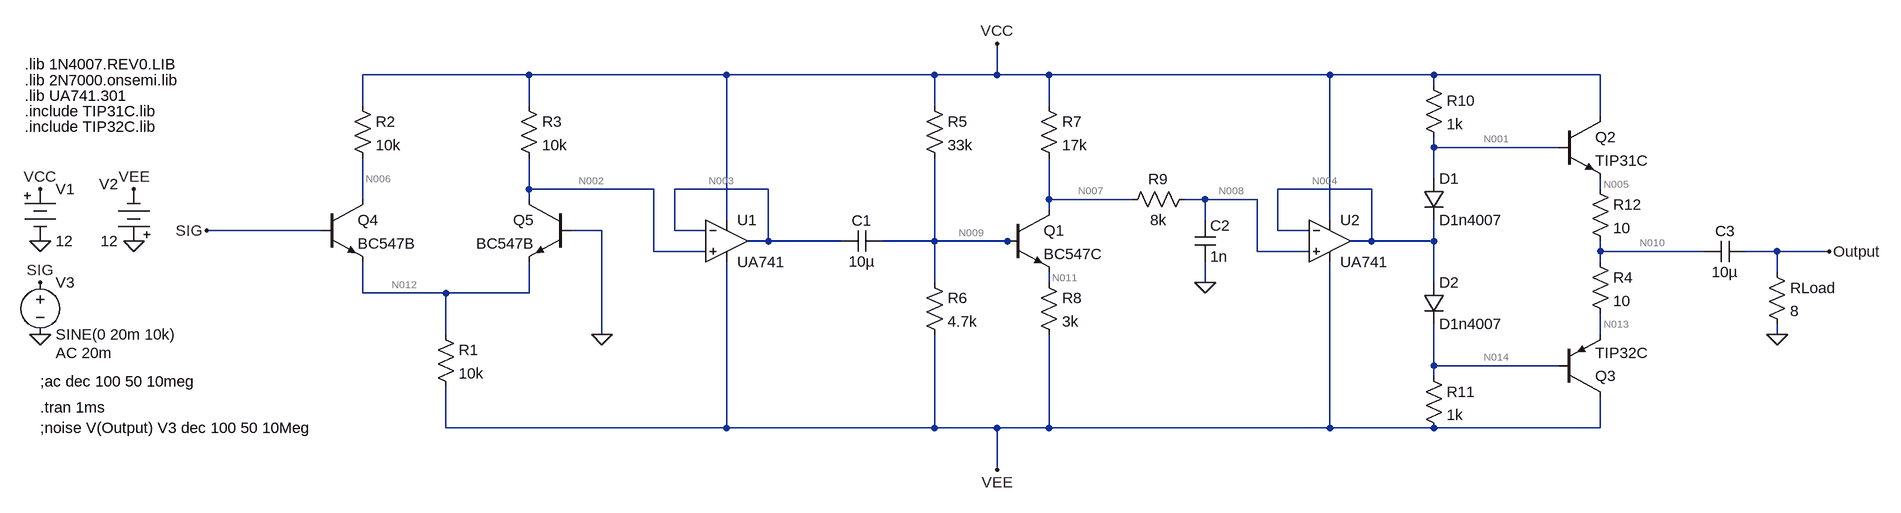
[diagram p0: schematic Final_Schematic.asc]
Final_Schematic.asc, the LTspice schematic file:
Version 4
SHEET 1 3124 736
WIRE 832 32 576 32
WIRE 1136 32 832 32
WIRE 1456 32 1136 32
WIRE 1552 32 1552 -16
WIRE 1552 32 1456 32
WIRE 1632 32 1552 32
WIRE 2064 32 1632 32
WIRE 2224 32 2064 32
WIRE 2480 32 2224 32
WIRE 2224 48 2224 32
WIRE 576 80 576 32
WIRE 832 80 832 32
WIRE 1456 80 1456 32
WIRE 1632 80 1632 32
WIRE 2480 96 2480 32
WIRE 2224 144 2224 128
WIRE 2416 144 2224 144
WIRE 2224 192 2224 144
WIRE 832 208 832 160
WIRE 1024 208 832 208
WIRE 1200 208 1056 208
WIRE 2128 208 1984 208
WIRE 2480 208 2480 192
WIRE 576 224 576 160
WIRE 832 224 832 208
WIRE 1632 224 1632 160
WIRE 1760 224 1632 224
WIRE 1872 224 1840 224
WIRE 1952 224 1872 224
WIRE 1632 240 1632 224
WIRE 1136 256 1136 32
WIRE 1872 256 1872 224
WIRE 2064 256 2064 32
WIRE 512 272 336 272
WIRE 944 272 896 272
WIRE 1056 272 1056 208
WIRE 1104 272 1056 272
WIRE 1984 272 1984 208
WIRE 2032 272 1984 272
WIRE 1200 288 1200 208
WIRE 1200 288 1168 288
WIRE 1312 288 1200 288
WIRE 1456 288 1456 160
WIRE 1456 288 1376 288
WIRE 1568 288 1456 288
WIRE 1584 288 1568 288
WIRE 2128 288 2128 208
WIRE 2128 288 2096 288
WIRE 2224 288 2224 256
WIRE 2224 288 2128 288
WIRE 1024 304 1024 208
WIRE 1104 304 1024 304
WIRE 1952 304 1952 224
WIRE 2032 304 1952 304
WIRE 2480 304 2480 288
WIRE 2640 304 2480 304
WIRE 2752 304 2704 304
WIRE 2832 304 2752 304
WIRE 2480 320 2480 304
WIRE 2752 336 2752 304
WIRE 1456 352 1456 288
WIRE 1632 352 1632 336
WIRE 1872 352 1872 320
WIRE 2224 352 2224 288
WIRE 576 368 576 320
WIRE 704 368 576 368
WIRE 832 368 832 320
WIRE 832 368 704 368
WIRE 704 432 704 368
WIRE 944 432 944 272
WIRE 2480 432 2480 400
WIRE 2752 432 2752 416
WIRE 2224 480 2224 416
WIRE 2416 480 2224 480
WIRE 2224 496 2224 480
WIRE 704 576 704 512
WIRE 1136 576 1136 320
WIRE 1136 576 704 576
WIRE 1456 576 1456 432
WIRE 1456 576 1136 576
WIRE 1552 576 1456 576
WIRE 1632 576 1632 432
WIRE 1632 576 1552 576
WIRE 2064 576 2064 320
WIRE 2064 576 1632 576
WIRE 2224 576 2064 576
WIRE 2480 576 2480 528
WIRE 2480 576 2224 576
WIRE 1552 640 1552 576
FLAG 80 288 0
FLAG 224 288 0
FLAG 80 208 VCC
FLAG 224 208 VEE
FLAG 80 432 0
FLAG 80 352 SIG
FLAG 944 432 0
FLAG 1872 352 0
FLAG 1552 640 VEE
FLAG 1552 -16 VCC
FLAG 2752 432 0
FLAG 336 272 SIG
FLAG 2832 304 Output
SYMBOL Misc\\battery 80 192 R0
WINDOW 123 0 0 Left 0
WINDOW 39 0 0 Left 0
SYMATTR InstName V1
SYMATTR Value 12
SYMBOL Misc\\battery 224 304 R180
WINDOW 0 24 104 Left 2
WINDOW 3 24 16 Left 2
WINDOW 123 0 0 Left 0
WINDOW 39 0 0 Left 0
SYMATTR InstName V2
SYMATTR Value 12
SYMBOL voltage 80 336 R0
WINDOW 123 24 124 Left 2
WINDOW 39 0 0 Left 0
SYMATTR Value2 AC 20m
SYMATTR InstName V3
SYMATTR Value SINE(0 20m 10k)
SYMBOL res 688 416 R0
SYMATTR InstName R1
SYMATTR Value 10k
SYMBOL res 560 64 R0
SYMATTR InstName R2
SYMATTR Value 10k
SYMBOL res 816 64 R0
SYMATTR InstName R3
SYMATTR Value 10k
SYMBOL OpAmps\\opamp2 1136 224 R0
SYMATTR InstName U1
SYMATTR Value UA741
SYMBOL cap 1376 272 R90
WINDOW 0 0 32 VBottom 2
WINDOW 3 32 32 VTop 2
SYMATTR InstName C1
SYMATTR Value 10µ
SYMBOL res 1440 64 R0
SYMATTR InstName R5
SYMATTR Value 33k
SYMBOL res 1440 336 R0
SYMATTR InstName R6
SYMATTR Value 4.7k
SYMBOL npn 1568 240 R0
SYMATTR InstName Q1
SYMATTR Value BC547C
SYMBOL res 1616 64 R0
SYMATTR InstName R7
SYMATTR Value 17k
SYMBOL res 1616 336 R0
SYMATTR InstName R8
SYMATTR Value 3k
SYMBOL res 1856 208 R90
WINDOW 0 0 56 VBottom 2
WINDOW 3 32 56 VTop 2
SYMATTR InstName R9
SYMATTR Value 8k
SYMBOL cap 1856 256 R0
SYMATTR InstName C2
SYMATTR Value 1n
SYMBOL OpAmps\\opamp2 2064 224 R0
SYMATTR InstName U2
SYMATTR Value UA741
SYMBOL res 2208 32 R0
SYMATTR InstName R10
SYMATTR Value 1k
SYMBOL diode 2208 192 R0
SYMATTR InstName D1
SYMATTR Value D1n4007
SYMBOL res 2208 480 R0
SYMATTR InstName R11
SYMATTR Value 1k
SYMBOL diode 2208 352 R0
SYMATTR InstName D2
SYMATTR Value D1n4007
SYMBOL npn 2416 96 R0
SYMATTR InstName Q2
SYMATTR Value TIP31C
SYMBOL pnp 2416 528 M180
SYMATTR InstName Q3
SYMATTR Value TIP32C
SYMBOL npn 512 224 R0
SYMATTR InstName Q4
SYMATTR Value BC547B
SYMBOL npn 896 224 M0
SYMATTR InstName Q5
SYMATTR Value BC547B
SYMBOL res 2464 304 R0
SYMATTR InstName R4
SYMATTR Value 10
SYMBOL res 2464 192 R0
SYMATTR InstName R12
SYMATTR Value 10
SYMBOL cap 2704 288 R90
WINDOW 0 0 32 VBottom 2
WINDOW 3 32 32 VTop 2
SYMATTR InstName C3
SYMATTR Value 10µ
SYMBOL res 2736 320 R0
SYMATTR InstName RLoad
SYMATTR Value 8
TEXT 56 16 Left 2 !.lib 1N4007.REV0.LIB
TEXT 56 40 Left 2 !.lib 2N7000.onsemi.lib
TEXT 56 64 Left 2 !.lib UA741.301
TEXT 56 88 Left 2 !.include TIP31C.lib
TEXT 56 112 Left 2 !.include TIP32C.lib
TEXT 80 544 Left 2 !.tran 1ms
TEXT 80 504 Left 2 !;ac dec 100 50 10meg
TEXT 80 576 Left 2 !;noise V(Output) V3 dec 100 50 10Meg

The netlist it stands for:
* Final_Schematic.asc
V1 VCC 0 12
V2 0 VEE 12
V3 SIG 0 SINE(0 20m 10k) AC 20m
R1 N012 VEE 10k
R2 VCC N006 10k
R3 VCC N002 10k
XU1 N002 N003 VCC VEE N003 UA741  ; pins In+ In- V+ V- OUT
C1 N009 N003 10µ
R5 VCC N009 33k
R6 N009 VEE 4.7k
Q1 N007 N009 N011 0 BC547C
R7 VCC N007 17k
R8 N011 VEE 3k
R9 N008 N007 8k
C2 N008 0 1n
XU2 N008 N004 VCC VEE N004 UA741  ; pins In+ In- V+ V- OUT
R10 VCC N001 1k
D1 N001 N004 D1n4007
R11 N014 VEE 1k
D2 N004 N014 D1n4007
Q2 VCC N001 N005 0 TIP31C
Q3 VEE N014 N013 0 TIP32C
Q4 N006 SIG N012 0 BC547B
Q5 N002 0 N012 0 BC547B
R4 N010 N013 10
R12 N005 N010 10
C3 Output N010 10µ
RLoad Output 0 8
.model D D
.lib standard.dio
.model NPN NPN
.model PNP PNP
.lib standard.bjt
.lib 1N4007.REV0.LIB
.lib 2N7000.onsemi.lib
.lib UA741.301
.include TIP31C.lib
.include TIP32C.lib
.tran 1ms
;ac dec 100 50 10meg
;noise V(Output) V3 dec 100 50 10Meg
.backanno
.end

* Results of the author's LTspice run, read from the files saved beside the schematic
* Operating Point, zero values left out:
*   V(vcc) = 12 V
*   V(vee) = -12 V
*   V(n012) = -621.3 mV
*   V(n006) = 6.329 V
*   V(n002) = 6.328 V
*   V(n003) = 6.328 V
*   V(n009) = -9.014 V
*   V(n007) = -1.427 V
*   V(n011) = -9.626 V
*   V(n008) = -1.427 V
*   V(n004) = -1.427 V
*   V(n001) = -753.3 mV
*   V(n014) = -2.089 V
*   V(n005) = -1.354 V
*   V(n013) = -1.516 V
*   V(n010) = -1.435 V
*   Ic(Q5) = 567.1 µA
*   Ib(Q5) = 1.818 µA
*   Ie(Q5) = -568.9 µA
*   Ic(Q4) = 567.1 µA
*   Ib(Q4) = 1.818 µA
*   Ie(Q4) = -568.9 µA
*   Ic(Q3) = -7.989 mA
*   Ib(Q3) = -147.4 µA
*   Ie(Q3) = 8.136 mA
*   Ic(Q2) = 7.988 mA
*   Ib(Q2) = 148 µA
*   Ie(Q2) = -8.136 mA
*   Ic(Q1) = 789.7 µA
*   Ib(Q1) = 1.523 µA
*   Ie(Q1) = -791.2 µA
*   I(D2) = 9.764 mA
*   I(D1) = 12.61 mA
*   I(R12) = 8.136 mA
*   I(R4) = 8.136 mA
*   I(R11) = 9.911 mA
*   I(R10) = 12.75 mA
*   I(R9) = -79.13 nA
*   I(R8) = 791.2 µA
*   I(R7) = 789.8 µA
*   I(R6) = 635.3 µA
*   I(R5) = 636.8 µA
*   I(R3) = 567.2 µA
*   I(R2) = 567.1 µA
*   I(R1) = 1.138 mA
*   I(V3) = -1.818 µA
*   I(V2) = -23.13 mA
*   I(V1) = -25.97 mA
*   Ix(u1:1) = 82.42 nA
*   Ix(u1:2) = 82.15 nA
*   Ix(u1:3) = 1.336 mA
*   Ix(u1:4) = -1.335 mA
*   Ix(u1:5) = -82.15 nA
*   Ix(u2:1) = 79.13 nA
*   Ix(u2:2) = 79.23 nA
*   Ix(u2:3) = 1.335 mA
*   Ix(u2:4) = -1.335 mA
*   Ix(u2:5) = 2.842 mA
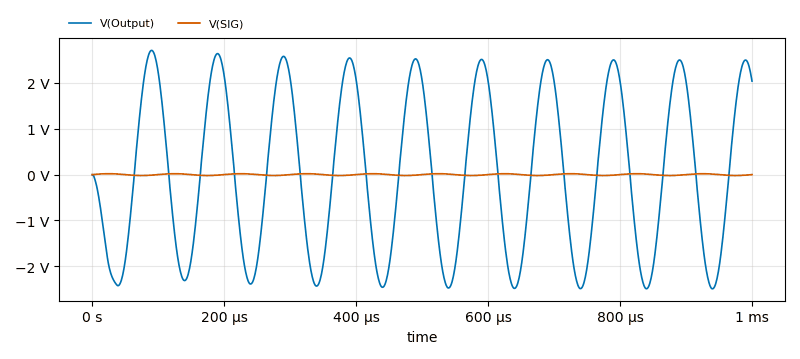
[diagram p1: Transient Analysis of Final_Schematic.asc, plotted from the saved traces]
* Transient Analysis, 1 run:
*   V(Output): min -2.489 V, max 2.709 V, average 21.67 mV, rms 1.774 V, last 2.038 V
*   V(SIG): min -20 mV, max 20 mV, average 171.5 nV, rms 14.14 mV, last 0 V